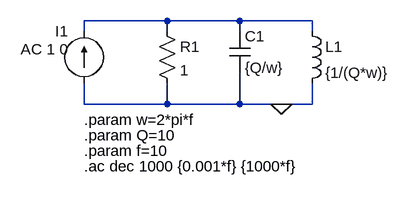
[diagram p0: schematic RLC paralelo.asc]
RLC paralelo.asc, the LTspice schematic file:
Version 4
SHEET 1 880 680
WIRE 160 128 32 128
WIRE 272 128 160 128
WIRE 384 128 272 128
WIRE 32 144 32 128
WIRE 160 144 160 128
WIRE 272 144 272 128
WIRE 384 144 384 128
WIRE 32 256 32 224
WIRE 160 256 160 224
WIRE 160 256 32 256
WIRE 272 256 272 208
WIRE 272 256 160 256
WIRE 336 256 272 256
WIRE 384 256 384 224
WIRE 384 256 336 256
FLAG 336 256 0
SYMBOL res 144 128 R0
SYMATTR InstName R1
SYMATTR Value 1
SYMBOL cap 256 144 R0
SYMATTR InstName C1
SYMATTR Value {Q/w}
SYMBOL ind 368 128 R0
SYMATTR InstName L1
SYMATTR Value {1/(Q*w)}
SYMBOL current 32 224 R180
WINDOW 0 24 80 Left 2
WINDOW 3 24 0 Left 2
WINDOW 123 24 52 Left 2
WINDOW 39 0 0 Left 0
SYMATTR InstName I1
SYMATTR Value ""
SYMATTR Value2 AC 1 0
TEXT 32 280 Left 2 !.param w=2*pi*f
TEXT 32 304 Left 2 !.param Q=10
TEXT 32 328 Left 2 !.param f=10
TEXT 32 352 Left 2 !.ac dec 1000 {0.001*f} {1000*f}

The netlist it stands for:
* RLC paralelo.asc
R1 N001 0 1
C1 N001 0 {Q/w}
L1 N001 0 {1/(Q*w)}
I1 0 N001 AC 1 0
.param w=2*pi*f
.param Q=10
.param f=10
.ac dec 1000 {0.001*f} {1000*f}
.backanno
.end